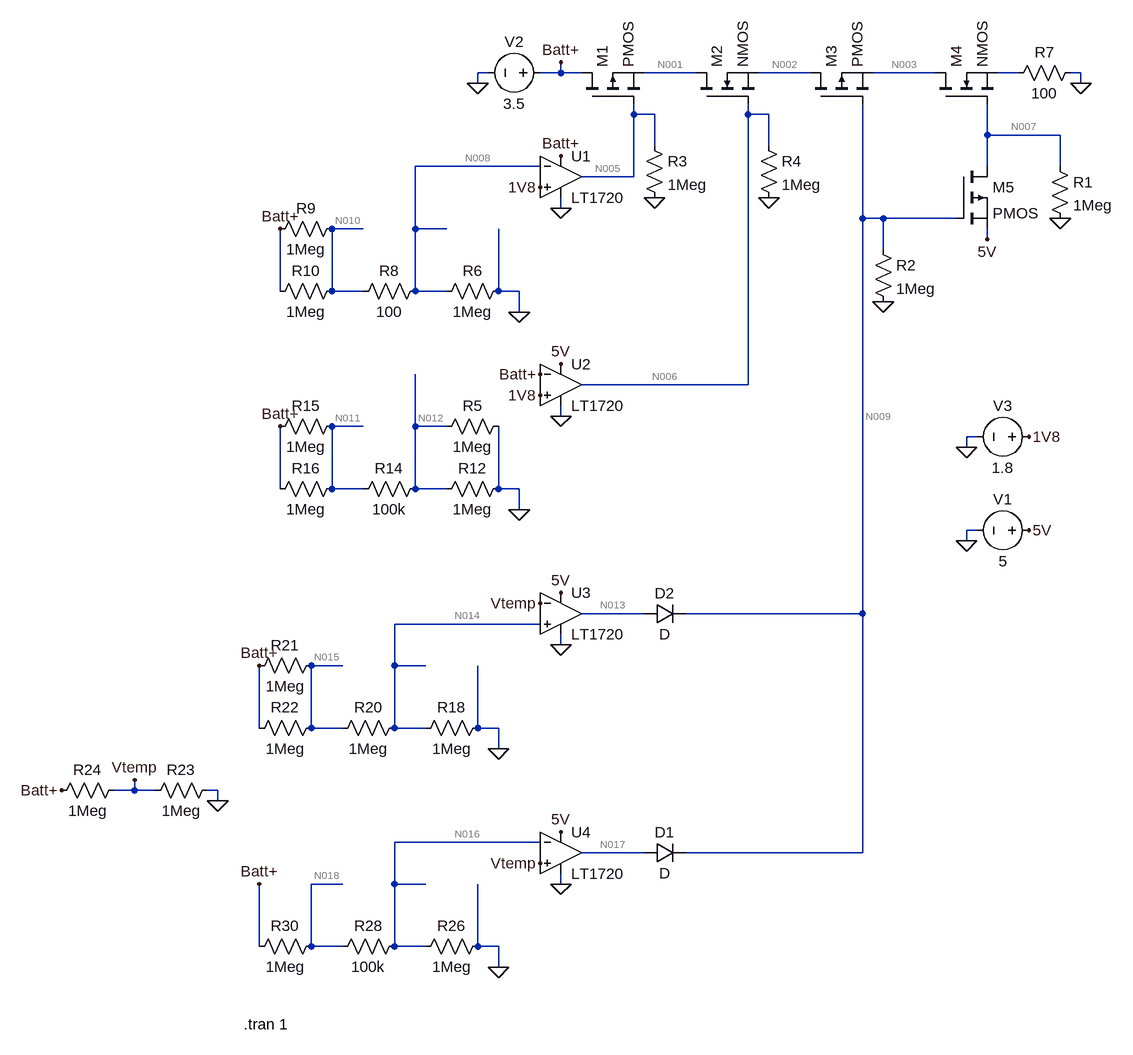
[diagram p0: schematic analogbms.asc]
analogbms.asc, the LTspice schematic file:
Version 4.1
SHEET 1 880 1464
WIRE -288 -16 -304 -16
WIRE -176 -16 -176 -32
WIRE -176 -16 -208 -16
WIRE -144 -16 -176 -16
WIRE 32 -16 -48 -16
WIRE 208 -16 128 -16
WIRE 400 -16 304 -16
WIRE 528 -16 496 -16
WIRE 624 -16 608 -16
WIRE -304 0 -304 -16
WIRE 624 0 624 -16
WIRE -64 48 -64 32
WIRE -32 48 -64 48
WIRE 112 48 112 32
WIRE 144 48 112 48
WIRE 480 80 480 32
WIRE 592 80 480 80
WIRE -32 96 -32 48
WIRE 144 96 144 48
WIRE -208 128 -400 128
WIRE 480 128 480 80
WIRE 592 128 592 80
WIRE -64 144 -64 48
WIRE -64 144 -144 144
WIRE -176 192 -176 176
WIRE 288 208 288 32
WIRE 320 208 288 208
WIRE 432 208 320 208
WIRE -480 224 -528 224
WIRE -400 224 -400 128
WIRE -352 224 -400 224
WIRE 480 240 480 224
WIRE 320 256 320 208
WIRE -608 320 -608 224
WIRE -528 320 -528 224
WIRE -480 320 -528 320
WIRE -400 320 -400 224
WIRE -352 320 -400 320
WIRE -272 320 -272 224
WIRE -240 320 -272 320
WIRE -240 352 -240 320
WIRE 112 464 112 48
WIRE 112 464 -144 464
WIRE -176 512 -176 496
WIRE -480 528 -528 528
WIRE -400 528 -400 448
WIRE -352 528 -400 528
WIRE 464 544 448 544
WIRE 448 560 448 544
WIRE -608 624 -608 528
WIRE -528 624 -528 528
WIRE -480 624 -528 624
WIRE -400 624 -400 528
WIRE -352 624 -400 624
WIRE -272 624 -272 528
WIRE -240 624 -272 624
WIRE -240 656 -240 624
WIRE 464 688 448 688
WIRE 448 704 448 688
WIRE -48 816 -144 816
WIRE 288 816 288 208
WIRE 288 816 16 816
WIRE -208 832 -432 832
WIRE -176 864 -176 848
WIRE -512 896 -560 896
WIRE -432 896 -432 832
WIRE -384 896 -432 896
WIRE -640 992 -640 896
WIRE -560 992 -560 896
WIRE -512 992 -560 992
WIRE -432 992 -432 896
WIRE -384 992 -432 992
WIRE -304 992 -304 896
WIRE -272 992 -304 992
WIRE -272 1024 -272 992
WIRE -832 1088 -832 1072
WIRE -832 1088 -864 1088
WIRE -800 1088 -832 1088
WIRE -704 1088 -720 1088
WIRE -704 1104 -704 1088
WIRE -208 1168 -432 1168
WIRE -48 1184 -144 1184
WIRE 288 1184 288 816
WIRE 288 1184 16 1184
WIRE -512 1232 -560 1232
WIRE -432 1232 -432 1168
WIRE -384 1232 -432 1232
WIRE -176 1232 -176 1216
WIRE -640 1328 -640 1232
WIRE -560 1328 -560 1232
WIRE -512 1328 -560 1328
WIRE -432 1328 -432 1232
WIRE -384 1328 -432 1328
WIRE -304 1328 -304 1232
WIRE -272 1328 -304 1328
WIRE -272 1360 -272 1328
FLAG 592 208 0
FLAG -304 0 0
FLAG 320 336 0
FLAG -32 176 0
FLAG 144 176 0
FLAG -176 432 5V
FLAG 480 240 5V
FLAG 448 704 0
FLAG 544 688 5V
FLAG -176 -32 Batt+
FLAG -176 112 Batt+
FLAG -176 192 0
FLAG -176 512 0
FLAG 448 560 0
FLAG 544 544 1V8
FLAG -208 160 1V8
FLAG -208 480 1V8
FLAG -608 224 Batt+
FLAG -240 352 0
FLAG -608 528 Batt+
FLAG -240 656 0
FLAG -640 896 Batt+
FLAG -272 1024 0
FLAG -640 1232 Batt+
FLAG -272 1360 0
FLAG -944 1088 Batt+
FLAG -704 1104 0
FLAG -176 784 5V
FLAG -176 1152 5V
FLAG -176 864 0
FLAG -176 1232 0
FLAG -832 1072 Vtemp
FLAG -208 1200 Vtemp
FLAG -208 800 Vtemp
FLAG 624 0 0
FLAG -208 448 Batt+
SYMBOL pmos -144 32 R270
SYMATTR InstName M1
SYMBOL nmos 32 32 R270
SYMATTR InstName M2
SYMBOL pmos 208 32 R270
SYMATTR InstName M3
SYMBOL nmos 400 32 R270
SYMATTR InstName M4
SYMBOL pmos 432 128 R0
SYMATTR InstName M5
SYMBOL res 576 112 R0
SYMATTR InstName R1
SYMATTR Value 1Meg
SYMBOL voltage -192 -16 R90
WINDOW 0 -32 56 VBottom 2
WINDOW 3 32 56 VTop 2
WINDOW 123 0 0 Left 0
WINDOW 39 0 0 Left 0
SYMATTR InstName V2
SYMATTR Value 3.5
SYMBOL res 304 240 R0
SYMATTR InstName R2
SYMATTR Value 1Meg
SYMBOL Comparators\\LT1720 -176 80 R0
SYMATTR InstName U1
SYMBOL Comparators\\LT1720 -176 400 R0
SYMATTR InstName U2
SYMBOL res -48 80 R0
SYMATTR InstName R3
SYMATTR Value 1Meg
SYMBOL res 128 80 R0
SYMATTR InstName R4
SYMATTR Value 1Meg
SYMBOL voltage 560 688 R90
WINDOW 0 -32 56 VBottom 2
WINDOW 3 32 56 VTop 2
WINDOW 123 0 0 Left 0
WINDOW 39 0 0 Left 0
SYMATTR InstName V1
SYMATTR Value 5
SYMBOL voltage 560 544 R90
WINDOW 0 -32 56 VBottom 2
WINDOW 3 32 56 VTop 2
WINDOW 123 0 0 Left 0
WINDOW 39 0 0 Left 0
SYMATTR InstName V3
SYMATTR Value 1.8
SYMBOL res -256 304 R90
WINDOW 0 0 56 VBottom 2
WINDOW 3 32 56 VTop 2
SYMATTR InstName R6
SYMATTR Value 1Meg
SYMBOL res -384 304 R90
WINDOW 0 0 56 VBottom 2
WINDOW 3 32 56 VTop 2
SYMATTR InstName R8
SYMATTR Value 100
SYMBOL res -512 208 R90
WINDOW 0 0 56 VBottom 2
WINDOW 3 32 56 VTop 2
SYMATTR InstName R9
SYMATTR Value 1Meg
SYMBOL res -512 304 R90
WINDOW 0 0 56 VBottom 2
WINDOW 3 32 56 VTop 2
SYMATTR InstName R10
SYMATTR Value 1Meg
SYMBOL res -256 608 R90
WINDOW 0 0 56 VBottom 2
WINDOW 3 32 56 VTop 2
SYMATTR InstName R12
SYMATTR Value 1Meg
SYMBOL res -384 608 R90
WINDOW 0 0 56 VBottom 2
WINDOW 3 32 56 VTop 2
SYMATTR InstName R14
SYMATTR Value 100k
SYMBOL res -512 512 R90
WINDOW 0 0 56 VBottom 2
WINDOW 3 32 56 VTop 2
SYMATTR InstName R15
SYMATTR Value 1Meg
SYMBOL res -512 608 R90
WINDOW 0 0 56 VBottom 2
WINDOW 3 32 56 VTop 2
SYMATTR InstName R16
SYMATTR Value 1Meg
SYMBOL Comparators\\LT1720 -176 752 R0
SYMATTR InstName U3
SYMBOL Comparators\\LT1720 -176 1120 R0
SYMATTR InstName U4
SYMBOL res -288 976 R90
WINDOW 0 0 56 VBottom 2
WINDOW 3 32 56 VTop 2
SYMATTR InstName R18
SYMATTR Value 1Meg
SYMBOL res -416 976 R90
WINDOW 0 0 56 VBottom 2
WINDOW 3 32 56 VTop 2
SYMATTR InstName R20
SYMATTR Value 1Meg
SYMBOL res -544 880 R90
WINDOW 0 0 56 VBottom 2
WINDOW 3 32 56 VTop 2
SYMATTR InstName R21
SYMATTR Value 1Meg
SYMBOL res -544 976 R90
WINDOW 0 0 56 VBottom 2
WINDOW 3 32 56 VTop 2
SYMATTR InstName R22
SYMATTR Value 1Meg
SYMBOL res -704 1072 R90
WINDOW 0 0 56 VBottom 2
WINDOW 3 32 56 VTop 2
SYMATTR InstName R23
SYMATTR Value 1Meg
SYMBOL res -848 1072 R90
WINDOW 0 0 56 VBottom 2
WINDOW 3 32 56 VTop 2
SYMATTR InstName R24
SYMATTR Value 1Meg
SYMBOL res -288 1312 R90
WINDOW 0 0 56 VBottom 2
WINDOW 3 32 56 VTop 2
SYMATTR InstName R26
SYMATTR Value 1Meg
SYMBOL res -416 1312 R90
WINDOW 0 0 56 VBottom 2
WINDOW 3 32 56 VTop 2
SYMATTR InstName R28
SYMATTR Value 100k
SYMBOL res -544 1312 R90
WINDOW 0 0 56 VBottom 2
WINDOW 3 32 56 VTop 2
SYMATTR InstName R30
SYMATTR Value 1Meg
SYMBOL diode -48 1200 R270
WINDOW 0 32 32 VTop 2
WINDOW 3 0 32 VBottom 2
SYMATTR InstName D1
SYMBOL diode -48 832 R270
WINDOW 0 32 32 VTop 2
WINDOW 3 0 32 VBottom 2
SYMATTR InstName D2
SYMBOL res -256 512 R90
WINDOW 0 0 56 VBottom 2
WINDOW 3 32 56 VTop 2
SYMATTR InstName R5
SYMATTR Value 1Meg
SYMBOL res 624 -32 R90
WINDOW 0 0 56 VBottom 2
WINDOW 3 32 56 VTop 2
SYMATTR InstName R7
SYMATTR Value 100
TEXT -664 1448 Left 2 !.tran 1

The netlist it stands for:
* analogbms.asc
M1 Batt+ N005 N001 N001 PMOS
M2 N001 N006 N002 N002 NMOS
M3 N002 N009 N003 N003 PMOS
M4 N003 N007 N004 N004 NMOS
M5 N007 N009 5V 5V PMOS
R1 N007 0 1Meg
V2 Batt+ 0 3.5
R2 N009 0 1Meg
X§U1 1V8 N008 Batt+ 0 N005 LT1720  ; pins In+ In- V+ V- OUT
X§U2 1V8 Batt+ 5V 0 N006 LT1720  ; pins In+ In- V+ V- OUT
R3 N005 0 1Meg
R4 N006 0 1Meg
V1 5V 0 5
V3 1V8 0 1.8
R6 0 N008 1Meg
R8 N008 N010 100
R9 N010 Batt+ 1Meg
R10 N010 Batt+ 1Meg
R12 0 N012 1Meg
R14 N012 N011 100k
R15 N011 Batt+ 1Meg
R16 N011 Batt+ 1Meg
X§U3 N014 Vtemp 5V 0 N013 LT1720  ; pins In+ In- V+ V- OUT
X§U4 Vtemp N016 5V 0 N017 LT1720  ; pins In+ In- V+ V- OUT
R18 0 N014 1Meg
R20 N014 N015 1Meg
R21 N015 Batt+ 1Meg
R22 N015 Batt+ 1Meg
R23 0 Vtemp 1Meg
R24 Vtemp Batt+ 1Meg
R26 0 N016 1Meg
R28 N016 N018 100k
R30 N018 Batt+ 1Meg
D1 N017 N009 D
D2 N013 N009 D
R5 0 N012 1Meg
R7 0 N004 100
.model D D
.lib standard.dio
.model NMOS NMOS
.model PMOS PMOS
.lib standard.mos
.tran 1
.lib LT1720.sub
.backanno
.end

* Results of the author's LTspice run, read from the files saved beside the schematic
* Operating Point, zero values left out:
*   V(1v8) = 1.8 V
*   V(5v) = 5 V
*   V(batt+) = 3.5 V
*   V(n001) = 3.5 V
*   V(n002) = 171.1 mV
*   V(n003) = 87.44 nV
*   V(n005) = 171 mV
*   V(n006) = 171.4 mV
*   V(n007) = 4.494 V
*   V(n008) = 2.333 V
*   V(n009) = 4.303 V
*   V(n010) = 2.333 V
*   V(n011) = 1.909 V
*   V(n012) = 1.591 V
*   V(n013) = 171.5 mV
*   V(n014) = 3.407 V
*   V(n015) = 3.469 V
*   V(n016) = 3.407 V
*   V(n017) = 4.817 V
*   V(n018) = 3.416 V
*   V(vtemp) = 3.416 V
*   I(D1) = 4.303 µA
*   I(D2) = -4.141 pA
*   I(R1) = 4.494 µA
*   I(R10) = -1.167 µA
*   I(R12) = -1.591 µA
*   I(R14) = -3.182 µA
*   I(R15) = -1.591 µA
*   I(R16) = -1.591 µA
*   I(R18) = -3.407 µA
*   I(R2) = 4.303 µA
*   I(R20) = -61.9 nA
*   I(R21) = -30.95 nA
*   I(R22) = -30.95 nA
*   I(R23) = -3.416 µA
*   I(R24) = -84.04 nA
*   I(R26) = -3.407 µA
*   I(R28) = -84.18 nA
*   I(R3) = 171 nA
*   I(R30) = -84.18 nA
*   I(R4) = 171.4 nA
*   I(R5) = -1.591 µA
*   I(R6) = -2.333 µA
*   I(R7) = -7.789 pA
*   I(R8) = -2.333 µA
*   I(R9) = -1.167 µA
*   I(V1) = -12.01 mA
*   I(V2) = -3.255 mA
*   I(V3) = 10 µA
*   Ib(M2) = -3.339 pA
*   Ib(M3) = -7.618 pA
*   Id(M1) = 7.789 pA
*   Id(M2) = 7.789 pA
*   Id(M3) = 7.789 pA
*   Id(M4) = 7.789 pA
*   Id(M5) = -4.494 µA
*   Is(M1) = -7.789 pA
*   Is(M2) = -4.45 pA
*   Is(M4) = -7.789 pA
*   Is(M5) = 4.494 µA